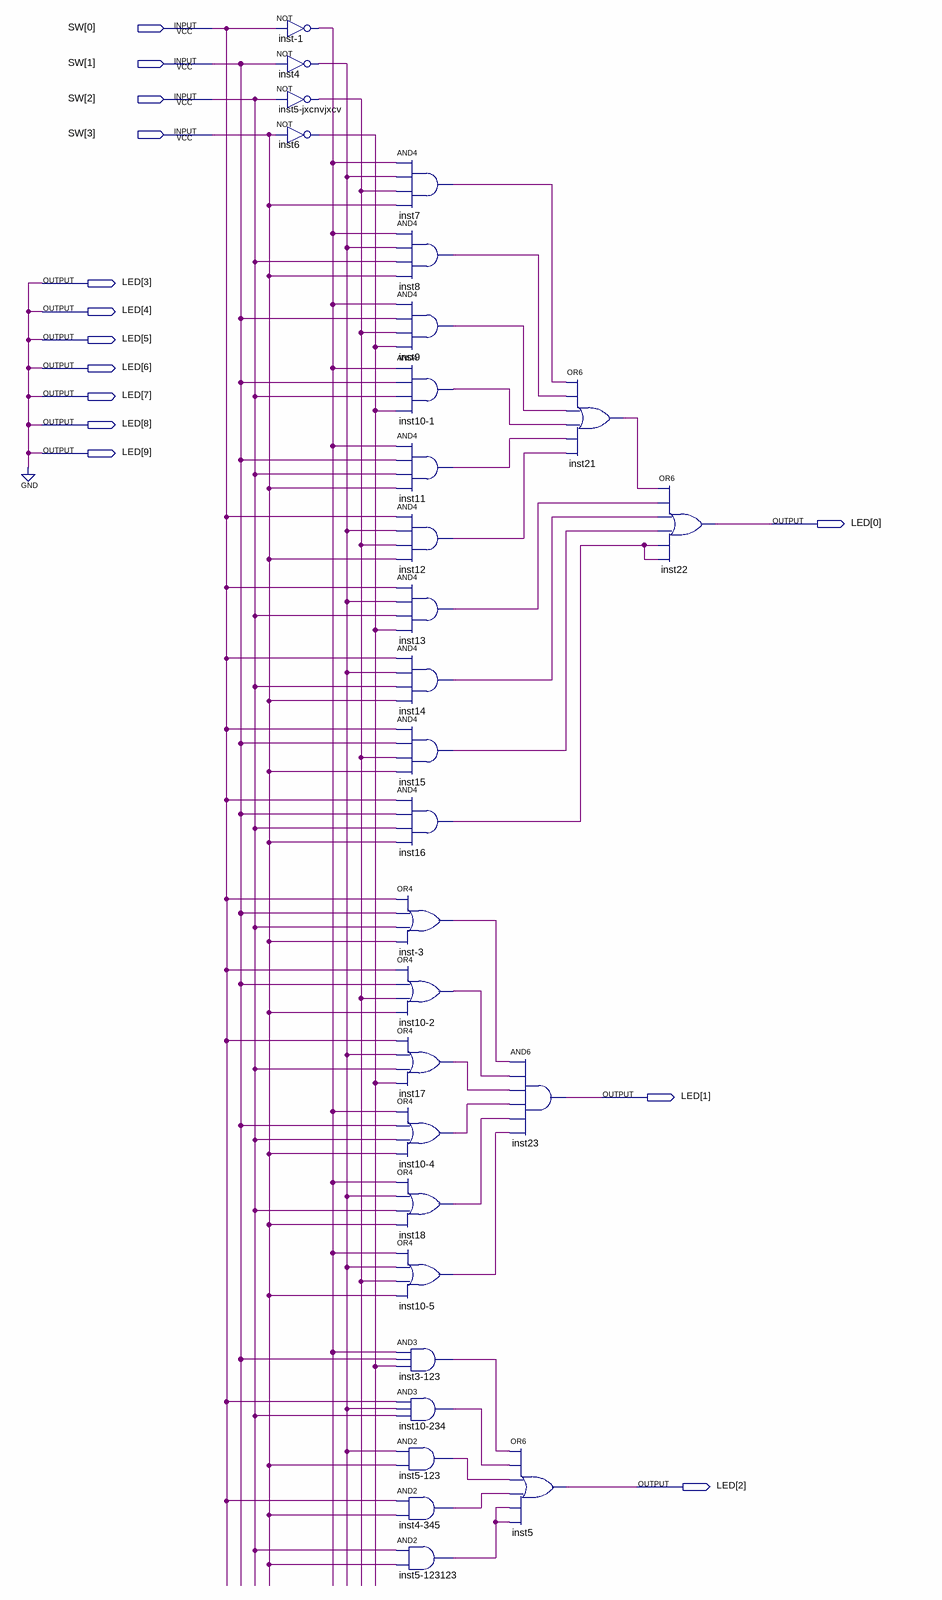
[diagram p0: schematic sheet]
// Quartus schematic rlab_02.bdf as structural Verilog: 29 symbols, 14 pins
module rlab_02 (
  input  [3:0] SW,
  output [9:0] LED
);

  wire inst3_123_out, inst4_345_out, inst4_out, inst5_123_out, inst5_123123_out, inst5_jxcnvjxcv_out,
       inst6_out, inst7_out, inst8_out, inst9_out, inst10_1_out, inst10_2_out, inst10_4_out, inst10_5_out,
       inst10_234_out, inst11_out, inst12_out, inst13_out, inst14_out, inst15_out, inst16_out, inst17_out,
       inst18_out, inst21_out, inst_1_out, inst_3_out;

  not \inst-1  (inst_1_out, SW[0]);
  not inst4 (inst4_out, SW[1]);
  not \inst5-jxcnvjxcv  (inst5_jxcnvjxcv_out, SW[2]);
  not inst6 (inst6_out, SW[3]);
  and inst7 (inst7_out, inst_1_out, inst4_out, inst5_jxcnvjxcv_out, SW[3]);
  and inst8 (inst8_out, inst_1_out, inst4_out, SW[2], SW[3]);
  and inst9 (inst9_out, inst_1_out, SW[1], inst5_jxcnvjxcv_out, inst6_out);
  and \inst10-1  (inst10_1_out, inst_1_out, SW[1], SW[2], inst6_out);
  and inst11 (inst11_out, inst_1_out, SW[1], SW[2], SW[3]);
  and inst12 (inst12_out, SW[0], inst4_out, inst5_jxcnvjxcv_out, SW[3]);
  and inst13 (inst13_out, SW[0], inst4_out, SW[2], inst6_out);
  and inst14 (inst14_out, SW[0], inst4_out, SW[2], SW[3]);
  and inst15 (inst15_out, SW[0], SW[1], inst5_jxcnvjxcv_out, SW[3]);
  and inst16 (inst16_out, SW[0], SW[1], SW[2], SW[3]);
  or \inst-3  (inst_3_out, SW[0], SW[1], SW[2], SW[3]);
  or \inst10-2  (inst10_2_out, SW[0], SW[1], inst5_jxcnvjxcv_out, SW[3]);
  or inst17 (inst17_out, SW[0], inst4_out, SW[2], inst6_out);
  or \inst10-4  (inst10_4_out, inst_1_out, SW[1], SW[2], SW[3]);
  or inst18 (inst18_out, inst_1_out, inst4_out, SW[2], SW[3]);
  or \inst10-5  (inst10_5_out, inst_1_out, inst4_out, inst5_jxcnvjxcv_out, SW[3]);
  and \inst3-123  (inst3_123_out, inst_1_out, SW[1], inst6_out);
  and \inst10-234  (inst10_234_out, SW[0], inst4_out, SW[2]);
  and \inst5-123  (inst5_123_out, inst4_out, SW[3]);
  and \inst4-345  (inst4_345_out, SW[0], SW[3]);
  and \inst5-123123  (inst5_123123_out, SW[2], SW[3]);
  and inst23 (LED[1], inst_3_out, inst10_2_out, inst17_out, inst10_4_out, inst18_out, inst10_5_out);
  or inst5 (LED[2], inst3_123_out, inst10_234_out, inst5_123_out, inst4_345_out, inst5_123123_out, inst5_123123_out);
  or inst21 (inst21_out, inst7_out, inst8_out, inst9_out, inst10_1_out, inst11_out, inst12_out);
  or inst22 (LED[0], inst21_out, inst13_out, inst14_out, inst15_out, inst16_out, inst16_out);

  assign LED[9:3] = {7{1'b0}};
endmodule
